# EAGLE design resonate (EAGLE 6.4)
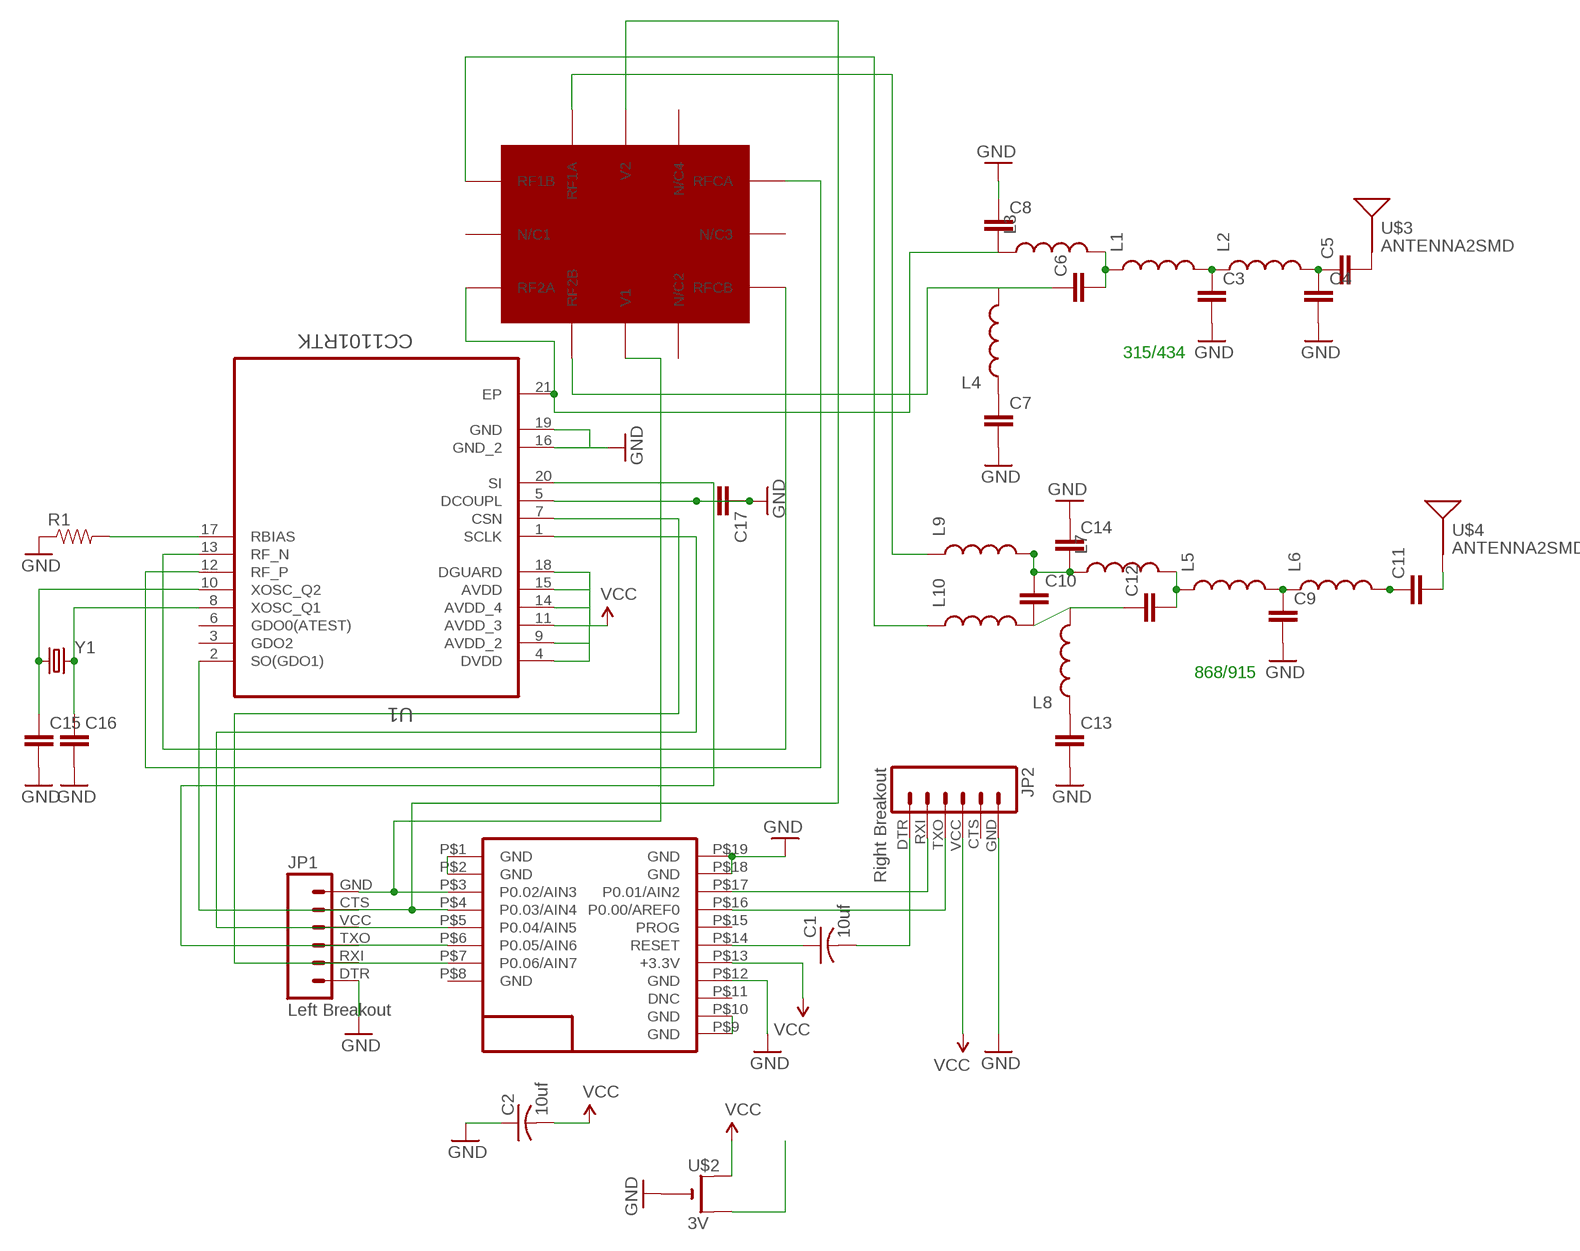
[diagram p0: schematic, sheet 1]

## Parts
C1  10uf  C-USC0603  [C0603]
C2  10uf  C-USC0603  [C0603]
C3  CAP0805  [0805]
C4  CAP0805  [0805]
C5  CAP0805  [0805]
C6  CAP0805  [0805]
C7  CAP0805  [0805]
C8  CAP0805  [0805]
C9  CAP0805  [0805]
C10  CAP0805  [0805]
C11  CAP0805  [0805]
C12  CAP0805  [0805]
C13  CAP0805  [0805]
C14  CAP0805  [0805]
C15  CAP0805  [0805]
C16  CAP0805  [0805]
C17  CAP0805  [0805]
JP1  Left Breakout  M06SIP  [1X06]
JP2  Right Breakout  M06SIP  [1X06]
L1  INDUCTOR0805  [0805]
L2  INDUCTOR0805  [0805]
L3  INDUCTOR0805  [0805]
L4  INDUCTOR0805  [0805]
L5  INDUCTOR0805  [0805]
L6  INDUCTOR0805  [0805]
L7  INDUCTOR0805  [0805]
L8  INDUCTOR0805  [0805]
L9  INDUCTOR0805  [0805]
L10  INDUCTOR0805  [0805]
R1  RESISTOR0603-RES  [0603-RES]
U1  CC1101RTK  [QFN50P400X400X90-21N]
U$1  RFD22301  [RFD21733]
U$2  3V  CR2032THM  [CR2032-THRU]
U$3  ANTENNA2SMD  [ANTENNA-CHIP2]
U$4  ANTENNA2SMD  [ANTENNA-CHIP2]
U$5  SKY13354-368LF  [SKY13354-368LF]
Y1  CRYSTAL5X3  [CRYSTAL-SMD-5X3]

## Nets
GND: C2.1 C3.2 C4.2 C7.2 C8.1 C9.2 C13.2 C14.1 C15.2 C16.2 C17.1 C17.2 JP1.DTR JP2.GND R1.1 U1.5(DCOUPL) U1.16(GND_2) U1.19(GND) U$1.P$12(GND) U$1.P$18(GND) U$1.P$19(GND) U$2.-
N$1: U$2.+2(+1)
N$4: U$1.P$9(GND) U$1.P$10(GND)
N$5: U$1.P$1(GND) U$1.P$2(GND)
N$6: C1.1 U$1.P$14(RESET)
N$7: C1.2 JP2.DTR
N$8: JP2.RXI U$1.P$17(P0.01/AIN2)
N$9: JP2.TXO U$1.P$16(P0.00/AREF0)
N$10: C3.1 L1.2 L2.1
N$11: C4.1 C5.1 L2.2
N$12: C6.1 L4.2 U$5.RF2B
N$13: C7.1 L4.1
N$14: C8.2 L3.1 U1.21(EP) U$5.RF2A
N$15: C9.1 L5.2 L6.1
N$16: C6.2 L1.1 L3.2
N$17: C11.1 L6.2
N$18: C10.2 C12.1 L8.2 L10.2
N$19: C13.1 L8.1
N$20: C10.1 C14.2 L7.1 L9.2
N$21: C12.2 L5.1 L7.2
N$22: C5.2 U$3.FEED(SIGNAL)
N$23: C11.2 U$4.FEED(SIGNAL)
N$24: U1.12(RF_P) U$5.RFCA
N$25: U1.13(RF_N) U$5.RFCB
N$26: C15.1 U1.10(XOSC_Q2) Y1.1
N$28: L9.1 U$5.RF1A
N$29: L10.1 U$5.RF1B
N$30: C16.1 U1.8(XOSC_Q1) Y1.3
N$31: R1.2 U1.17(RBIAS)
N$32: U1.20(SI)
P2: JP1.GND U$1.P$3(P0.02/AIN3) U$5.V1
P3: JP1.CTS U1.2(SO(GDO1)) U$1.P$4(P0.03/AIN4) U$5.V2
P4: JP1.VCC U1.1(SCLK) U$1.P$5(P0.04/AIN5)
P5: JP1.TXO U$1.P$6(P0.05/AIN6)
P6: JP1.RXI U1.7(CSN) U$1.P$7(P0.06/AIN7)
VCC: C2.2 JP2.VCC U1.4(DVDD) U1.9(AVDD_2) U1.11(AVDD_3) U1.14(AVDD_4) U1.15(AVDD) U1.18(DGUARD) U$1.P$13(+3.3V) U$2.+1(+)
Unconnected: JP2.CTS U1.3(GDO2) U1.6(GDO0(ATEST)) U$1.P$8(GND) U$1.P$11(DNC) U$1.P$15(PROG) U$5.N/C2 U$5.N/C3 U$5.N/C4 U$5.N/C(N/C1)

## Notes on the sheet
- 315/434
- 868/915

## Library data of the parts
C1 C2 = adafruit:C-US: CAPACITOR, American symbol
C3-C17 = SparkFun-Capacitors:CAP: Capacitor Standard 0603 ceramic capacitor, and 0.1" leaded capacitor.
JP1 JP2 = SparkFun-Connectors:M06: Header 6 Standard 6-pin 0.1" header. Use with straight break away headers (SKU : PRT-00116), right angle break away headers (PRT-00553), swiss pins (PRT-00743), machine pins (PRT-00117), and female headers (PRT-00115). Molex polarized connector foot print use with SKU : PRT-08094 with associated crimp pins and housings. NOTES ON THE VARIANTS LOCK and LOCK_LONGPADS... This footprint was designed to help hold the alignment of a through-hole component (i.e. 6-pin header) while soldering it into place. You may notice that each hole has been shifted either up or down by 0.005 of an inch from it's more standard position (which is a perfectly straight line). This slight alteration caused the pins (the squares in the middle) to touch the edges of the holes. Because they are alternating, it causes a "brace" to hold the component in place. 0.005 has proven to be the perfect amount of "off-center" position when using our standard breakaway headers. Although looks a little odd when you look at the bare footprint, once you have a header in there, the alteration is very hard to notice. Also,if you push a header all the way into place, it is covered up entirely on the bottom side. This idea of altering the position of holes to aid alignment will be further integrated into the Sparkfun Library for other footprints. It can help hold any component with 3 or more connection pins.
L1-L10 = SparkFun-Passives:INDUCTOR: Inductors Basic Inductor/Choke - 0603 and 1206. Footprints are not proven and vary greatly between part numbers. SRN6045- 33uH, 20% 1.4A SDR0403-560KL - 56uH, 10%, 500mA RMS/740mA peak
R1 = SparkFun-Passives:RESISTOR: Resistor Basic schematic elements and footprints for 0603, 1206, and PTH resistors.
U1 = Texas Instruments_By_element14_Batch_1:CC1101RTK: Low-Power Sub-1 GHz RF Transceiver; MPN: CC1101RTK; OC_FARNELL: 1555264; OC_NEWARK: 50M8833; PACKAGE: QFN-20; SUPPLIER: Texas Instruments
U$1 = RFD22301-11.25.13:RFD22301: RF Digital RFD22301
U$2 = adafruit:CR2032
U$3 U$4 = SparkFun-RF:ANTENNA2: Chip antenna Single endded antenna. Common with smaller chip antennas. CHIP4 package is the GPS Chip Antenna SKU: GPS-08418. CHIP5 package is 2.4GHz chip antenna SKU: WRL-00144.
U$5 = skyworks:SKY13354-368LF
Y1 = SparkFun-FreqCtrl:CRYSTAL: Various standard crystals. Proven footprints. Spark Fun Electronics SKU : COM-00534

## Board
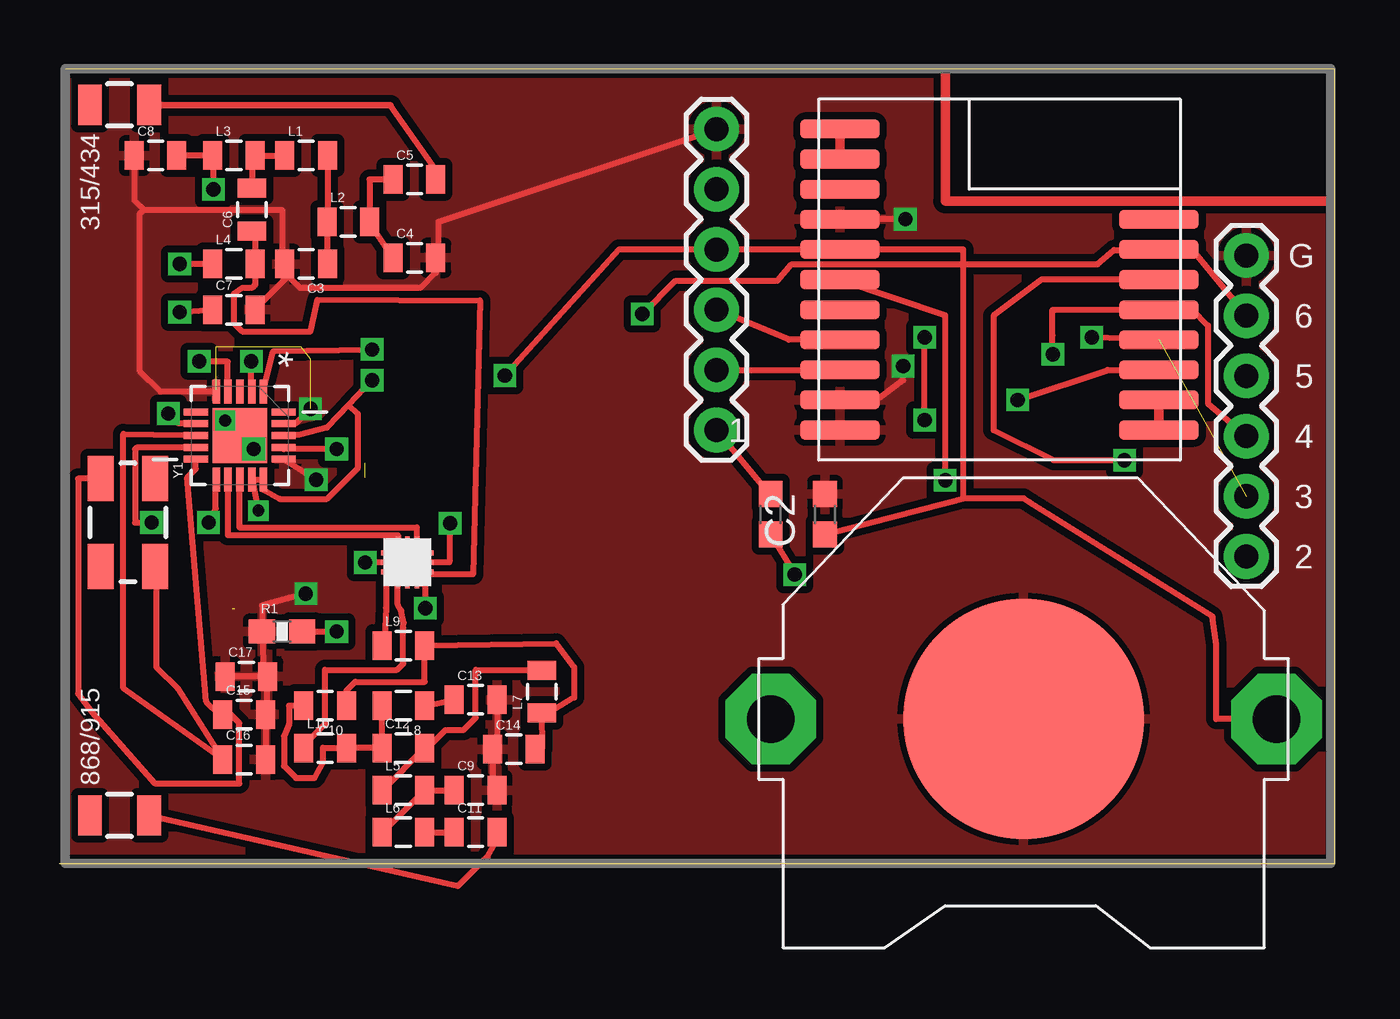
[diagram p1: board, top side]
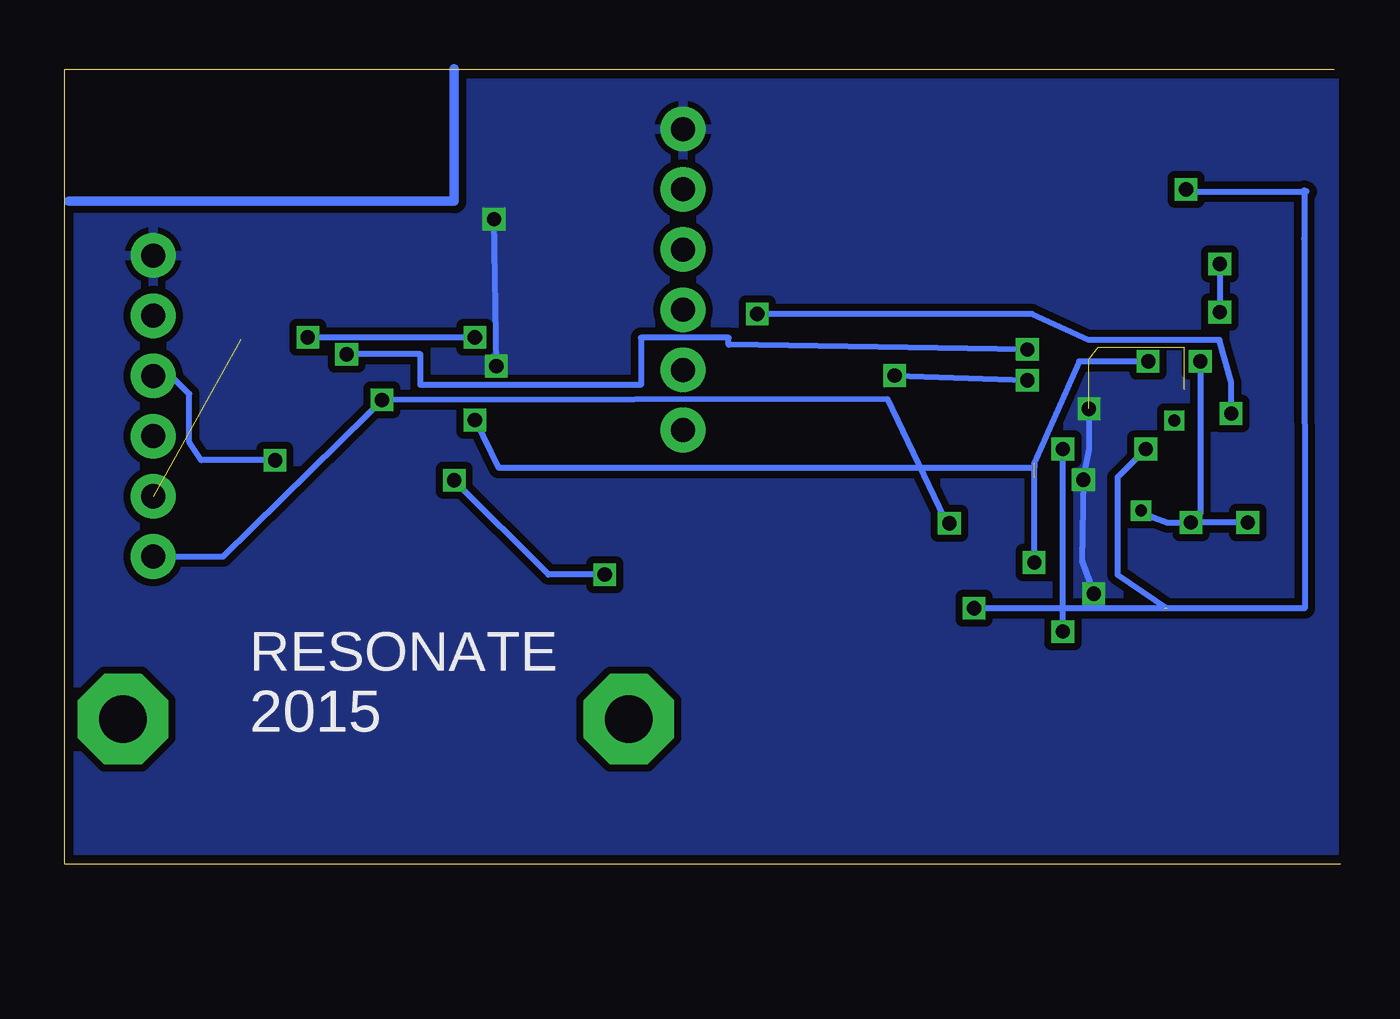
[diagram p2: board, bottom side, seen from below]

Size 53.81 x 33.53 mm. Coordinates in mm from the lower left corner, seen from the top.
Outline: 0.25,33.53 53.81,33.53 53.81,0 0,0
Copper layers (1*16): Top 0.0356mm / dielectric 1.5011mm / Bottom 0.0356mm
Design rules "LaenPCBOrder": minimum track width 6mil, minimum drill 13mil, track to track 6mil, track to pad 6mil, pad to pad 6mil, via to via 6mil, smd to smd 6mil, copper to edge 15mil, drill to drill 6mil, minimum pad ring 7mil, minimum via ring 7mil, stop-mask expansion 3mil, vias tented up to drill 0mil, thermal gap 10mil

### Footprints (pad centres in the part's own frame; a part is rotated, then mirrored left to right if it is on the bottom)
C0603 = smd 1.1 x 1: 1 -0.85,0; 2 0.85,0
0805 = smd 0.8 x 1.2: 1 -0.9,0; 2 0.9,0
1X06 = drill 1.016 pad 1.88: CTS 10.16,0; DTR 0,0; GND 12.7,0; RXI 2.54,0; TXO 5.08,0; VCC 7.62,0
0603-RES = smd 1.1 x 1: 1 -0.85,0; 2 0.85,0
QFN50P400X400X90-21N = smd 1.016 x 0.305: 1 -1.854,0.991; 2 -1.854,0.508; 3 -1.854,0; 4 -1.854,-0.508; 5 -1.854,-0.991; 11 1.854,-0.991; 12 1.854,-0.508; 13 1.854,0; 14 1.854,0.508; 15 1.854,0.991 | smd 0.305 x 1.016: 6 -0.991,-1.854; 7 -0.508,-1.854; 8 0,-1.854; 9 0.508,-1.854; 10 0.991,-1.854; 16 0.991,1.854; 17 0.508,1.854; 18 0,1.854; 19 -0.508,1.854; 20 -0.991,1.854 | smd 2.311 x 2.311: 21 0,0
RFD21733 = smd 3.353 x 0.813: P$1 -6.731,6.35; P$2 -6.731,5.08; P$3 -6.731,3.81; P$4 -6.731,2.54; P$5 -6.731,1.27; P$6 -6.731,0; P$7 -6.731,-1.27; P$8 -6.731,-2.54; P$9 6.731,-6.35; P$10 6.731,-5.08; P$11 6.731,-3.81; P$12 6.731,-2.54; P$13 6.731,-1.27; P$14 6.731,0; P$15 6.731,1.27; P$16 6.731,2.54; P$17 6.731,3.81; P$18 6.731,5.08; P$19 6.731,6.35
CR2032-THRU = drill 2 pad 3.81 octagon: +1 -10.668,0; +2 10.668,0 | smd 10.16 x 10.16: - 0,0
ANTENNA-CHIP2 = smd 1.7 x 1: FEED 0,1.25; P$2 0,-1.25
SKY13354-368LF = smd 0.406 x 0.203: N/C -0.9,0; N/C3 0.9,0; RF1B -0.9,0.4; RF2A -0.9,-0.4; RFCA 0.9,0.4; RFCB 0.9,-0.4 | smd 0.203 x 0.406: N/C2 0.4,-0.9; N/C4 0.4,0.9; RF1A -0.4,0.9; RF2B -0.4,-0.9; V1 0,-0.9; V2 0,0.9
CRYSTAL-SMD-5X3 = smd 1.9 x 1.1: 1 -1.85,-1.15; 2 1.85,-1.15; 3 1.85,1.15; 4 -1.85,1.15

### Placement (x,y rotation side)
C1  30.01,14.74 90 top
C2  32.3,14.74 270 top
C3  10.41,25.31 180 top
C4  14.99,25.56 0 top
C5  14.99,28.87 0 top
C6  8.13,27.6 90 top
C7  7.37,23.38 0 top
C8  4.06,29.88 0 top
C9  17.56,3.11 0 top
C10  11.21,6.66 180 top
C11  17.56,1.33 0 top
C12  14.52,4.88 0 top
C13  17.56,6.92 0 top
C14  19.18,4.83 0 top
C15  7.8,6.3 0 top
C16  7.8,4.4 0 top
C17  7.9,7.9 0 top
JP1  50.08,25.66 270 top
JP2  27.73,18.3 90 top
L1  10.41,29.88 0 top
L2  12.19,27.09 0 top
L3  7.37,29.88 0 top
L4  7.37,25.31 0 top
L5  14.52,3.11 0 top
L6  14.52,1.33 0 top
L7  20.36,7.26 90 top
L8  14.52,6.66 180 top
L9  14.52,9.2 0 top
L10  11.21,4.88 0 top
R1  9.4,9.8 0 top
U1  7.62,18.07 270 top
U$1  39.67,24.65 180 top
U$2  40.68,6.11 180 top
U$3  2.54,32.01 270 top
U$4  2.54,2.04 270 top
U$5  14.69,12.71 90 top
Y1  2.9,14.4 270 top

### Tracks (layer width: path | path; a pad name or v marks a point on that pad's centre or on a via)
GND  (via drill 0.6)  (4 unrouted)
  Top 0.254: 8.38,23.53 9.65,24.8 | C8.1 3.16,27.99 3.56,27.6 | 3.56,27.6 9.4,27.6 9.4,25.43 C3.2 9.4,25.31 9.4,25.06 9.65,24.8 | 9.65,24.8 10.16,24.29 15.24,24.29 15.89,24.94 C4.2 16,26.07 16,27.09 JP2.GND | U$1.P$18 33.03,19.57 33.1,19.5 34.4,19.5 35.6,20.4 v35.6,21 | v35.7,27.2 U$1.P$12 | C13.2 18.46,5.01 C14.1 18.28,3.29 C9.2 | C17.2 C15.2 C16.2 | C17.2 8.6,8.5 R1.1 8.55,10.9 v10.4,11.4 | C17.2 C17.1 | U1.16 v10.84,16.2 | U1.5 4.28,19.92 3.4,20.8 3.4,27.44 3.56,27.6 | U1.19 9.98,18.58 v10.6,19.2
  Top 0.305: C7.2 8.38,23.53
  Top 0.406: U$1.P$12
  Bottom 0.254: v35.6,21 v35.7,27.2 | v10.4,11.4 10.9,12.78 v10.84,16.2 10.8,16.54 10.6,17.5 v10.6,19.2
  pour Top (isolate 0.305): 0.25,33.54 53.64,33.54 53.64,0.01 0.25,0.01
  pour Bottom (isolate 0.305): 0.25,33.54 53.64,33.54 53.64,0.01 0.25,0.01
N$2
  Top 0.406: 37.38,33.54 37.38,27.95 53.64,27.95
N$3
  Bottom 0.406: 37.38,33.54 37.38,27.95 53.64,27.95
N$4
  Top 0.406: U$1.P$9 U$1.P$10
N$5
  Top 0.406: 46.52,19.57 U$1.P$2 U$1.P$1
N$6  (via drill 0.6)
  Top 0.254: U$1.P$14 37.38,23.15 v37.38,16.18 | C1.1 v31.03,12.2
  Bottom 0.254: v31.03,12.2 33.4,12.2 v37.38,16.18
N$7
  Top 0.254: C1.2 29.76,15.85 JP2.DTR
N$8
  Top 0.254: JP2.RXI U$1.P$17
N$9
  Top 0.254: U$1.P$16 30.78,22.11 JP2.TXO
N$10
  Top 0.254: L1.2 11.31,27.11 | L2.1 11.29,25.33
  Top 0.305: 11.31,27.11 L2.1 | 11.29,25.33 C3.1
N$11
  Top 0.254: C4.1 13.07,27.07 L2.2 13.09,28.87 C5.1 14.22,28.87
N$12
  Top 0.254: C6.1 8.27,26.33 L4.2 8.27,24.43 8.13,24.29 7.72,24.29 7.36,24.04 7.36,22.82 7.72,22.46 10.6,22.46 10.9,23.8 17.75,23.76 17.45,12.21 15.69,12.21 U$5.RF2B
N$13  (via drill 0.6)
  Top 0.254: L4.1 v5.08,25.31 | v5.08,23.28 C7.1
  Bottom 0.254: v5.08,25.31 v5.08,23.28
N$14  (via drill 0.6)  (2 unrouted)
  Top 0.254: C8.2 L3.1 v6.5,28.45 | v15.45,10.78 15.45,11.81 U$5.RF2A | U1.21 v8.2,17.5
  Bottom 0.254: v6.5,28.45 6.5,28.36 1.42,28.36 1.52,28.4 1.52,26.36 1.5,10.78 7.3,10.78 | 7.3,10.78 v15.45,10.78 | v8.2,17.5 9.4,16.3 9.4,12.2 7.3,10.78
N$15
  Top 0.254: L6.1 13.64,1.33 L5.2 C9.1
N$16
  Top 0.254: L1.1 L3.2 8.13,29.88 C6.2
N$17
  Top 0.254: L6.2 C11.1
N$18
  Top 0.254: C10.2 9.69,6.66 9.69,5.9 9.48,5.39 9.48,4.12 9.99,3.61 10.77,3.61 11.12,4.27 11.12,4.89 L10.2 C12.1 L8.2
N$19
  Top 0.254: L8.1 C13.1
N$20
  Top 0.254: C14.2 20.38,4.88 L7.1 | 20.8,6.45 21.73,7.02 21.73,8.29 20.97,9.3 L9.2 15.42,7.68 12.48,7.68 12.11,7.31 C10.1
  Top 0.305: 20.8,6.45 L7.1
N$21
  Top 0.254: L5.1 13.64,3.11 C12.2 15.53,4.88 16.29,5.65 17.06,5.65 17.56,6.15 17.56,8.19 20.36,8.19 L7.2
N$22
  Top 0.254: 16,28.87 16,29.12 13.97,31.99
  Top 0.305: C5.2 16,28.87 | 13.97,31.99 U$3.FEED
N$23
  Top 0.254: U$4.FEED 16.82,-0.94 18.07,0.31 18.58,1.19 C11.2
N$24
  Top 0.254: U1.12 7.11,13.87 14.29,13.87 U$5.RFCA
N$25
  Top 0.254: U1.13 7.6,16.21 7.6,14.2 15.09,14.2 U$5.RFCB
N$26
  Top 0.254: Y1.1 0.8,16.25 0.8,7.17 1.38,6.4 4.02,3.4 7.6,3.38 7.6,5.94 7.24,6.3 C15.1 6.74,6.3 6.2,6.84 5.4,16.3 5.77,16.66 U1.10
N$28
  Top 0.254: U$5.RF1A 13.79,10.8 13.75,9.96 13.75,9.59
  Top 0.305: 13.75,9.59 L9.1
N$29
  Top 0.254: 10.31,5 11.21,5.9 11.21,8.19 14.26,8.19 14.52,8.44 14.52,9.96 14.53,10.18 14.43,10.68 14.28,10.94 14.28,11.71 U$5.RF1B
  Top 0.305: L10.1 10.31,5
N$30
  Top 0.254: Y1.3 4.1,12.55 4.1,8.29 4.99,7.4 C16.1 2.7,7.4 2.7,18.14 5.26,18.1 5.77,18.1 U1.8
N$31  (via drill 0.6)
  Top 0.254: R1.2 v11.7,9.8 | v11.7,17.5 9.47,17.5 U1.17
  Bottom 0.254: v11.7,9.8 v11.7,17.5
N$33  (via drill 0.5)
  other vias: 7,18.7
P2  (via drill 0.6)
  Top 0.254: v16.49,14.37 16.49,12.78 16.46,12.78 16.46,12.71 U$5.V1 | v40.43,19.57 44.24,20.84 U$1.P$3
  Bottom 0.254: v16.49,14.37 16.7,14.57 19.1,19.6 v40.43,19.57 41,19 47.13,12.96 JP1.GND
P3  (via drill 0.6)  (2 unrouted)
  Top 0.254: U$1.P$4 v43.56,22.21 | U$5.V2 v12.91,12.71 | v36.51,18.72 v36.51,22.21 | U1.2 8.1,19.92 v8.1,21.2
  Bottom 0.254: v12.91,12.71 12.91,16.7 | 12.91,16.7 12.91,16.9 11.01,21.2 v8.1,21.2 | 12.91,16.7 35.5,16.7 36.49,18.7 v36.51,18.72 | v36.51,22.21 42.46,22.21 v43.56,22.21
P4  (via drill 0.6)
  Top 0.254: 47.79,23.38 48.46,22.72 48.46,19.41 JP1.VCC | U1.1 9.02,21.62 v13.2,21.7 | v41.92,21.5 41.9,22.3 41.9,23.38 U$1.P$5
  Top 0.406: U$1.P$5 47.79,23.38
  Bottom 0.254: v13.2,21.7 25.8,21.9 25.8,22.2 29.5,22.2 29.5,20.2 38.8,20.2 38.8,21.5 v41.92,21.5
P5  (via drill 0.6)
  Top 0.254: U$1.P$6 41.44,24.65 39.41,23.12 39.41,18.3 41.95,17.03 v44.94,17.03
  Bottom 0.254: v44.94,17.03 48.05,17.03 48.56,17.79 48.56,19.82 49.32,20.58
  Bottom 0.406: 49.32,20.58 JP1.TXO
P6  (via drill 0.6)
  Top 0.254: 47.79,25.92 JP1.RXI | U1.7 5.02,18.58 v4.6,19 | v24.6,23.2 26,24.6 30.3,24.6 30.9,25.3 43.8,25.3 44.5,25.9 46.38,25.9 U$1.P$7
  Top 0.406: U$1.P$7 47.79,25.92
  Bottom 0.254: v4.6,19 4.6,20.3 5.1,22.1 10.6,22.1 13,23.2 v24.6,23.2
VCC  (via drill 0.5 pad 0.25, 0.6)
  Top 0.254: C2.2 38.14,15.42 | 38.14,15.42 38.14,25.92 U$1.P$13 JP2.VCC 23.62,25.92 v18.8,20.6 | U$2.+1 48.81,6.11 48.81,9.25 48.65,10.42 40.94,15.25 40.68,15.42 38.14,15.42 | v13.2,20.4 12.22,19.36 | 12.22,19.36 11.3,18.4 10.1,18.1 9.5,18.1 U1.18 | U1.9 3.26,17.56 3.2,17.5 3.2,14.4 v3.9,14.4 | v6.3,14.4 6.6,15 6.6,16.18 U1.11 | U1.4 7.11,21.19 v5.9,21.2 | 12.22,19.36 12.6,18.98 12.6,16.7 11.3,15.4 9.3,15.4 8.61,15.79 U1.15 U1.14 v8.4,14.9
  Bottom 0.254: v18.8,20.6 v13.2,20.4 | v3.9,14.4 v6.3,14.4 | v5.9,21.2 5.9,14.8 v6.3,14.4 | v8.4,14.9 8.4,14.83 8.43,14.83 7.3,14.4 v6.3,14.4

### Text on the board
tPlace: G | 6 | 5 | 1 | 4 | 3 | 2
bPlace: RESONATE | 2015
tNames: 315/434 | 868/915